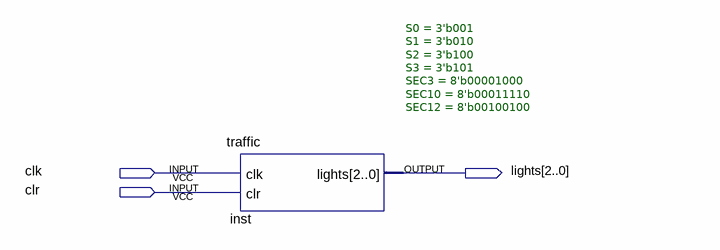
[diagram p0: schematic sheet]
// Quartus schematic Block6.bdf as structural Verilog: 1 symbols, 3 pins
module Block6 (
  input  clk,
  input  clr,
  output [2:0] lights
);

  traffic #(.S0(3'b001), .S1(3'b010), .S2(3'b100), .S3(3'b101), .SEC3(8'b00001000), .SEC10(8'b00011110), .SEC12(8'b00100100)) inst (
    .clk(clk), .clr(clr), .lights(lights));
endmodule
